# Altium project EP4CE6E22C8最小系统.PrjPCB
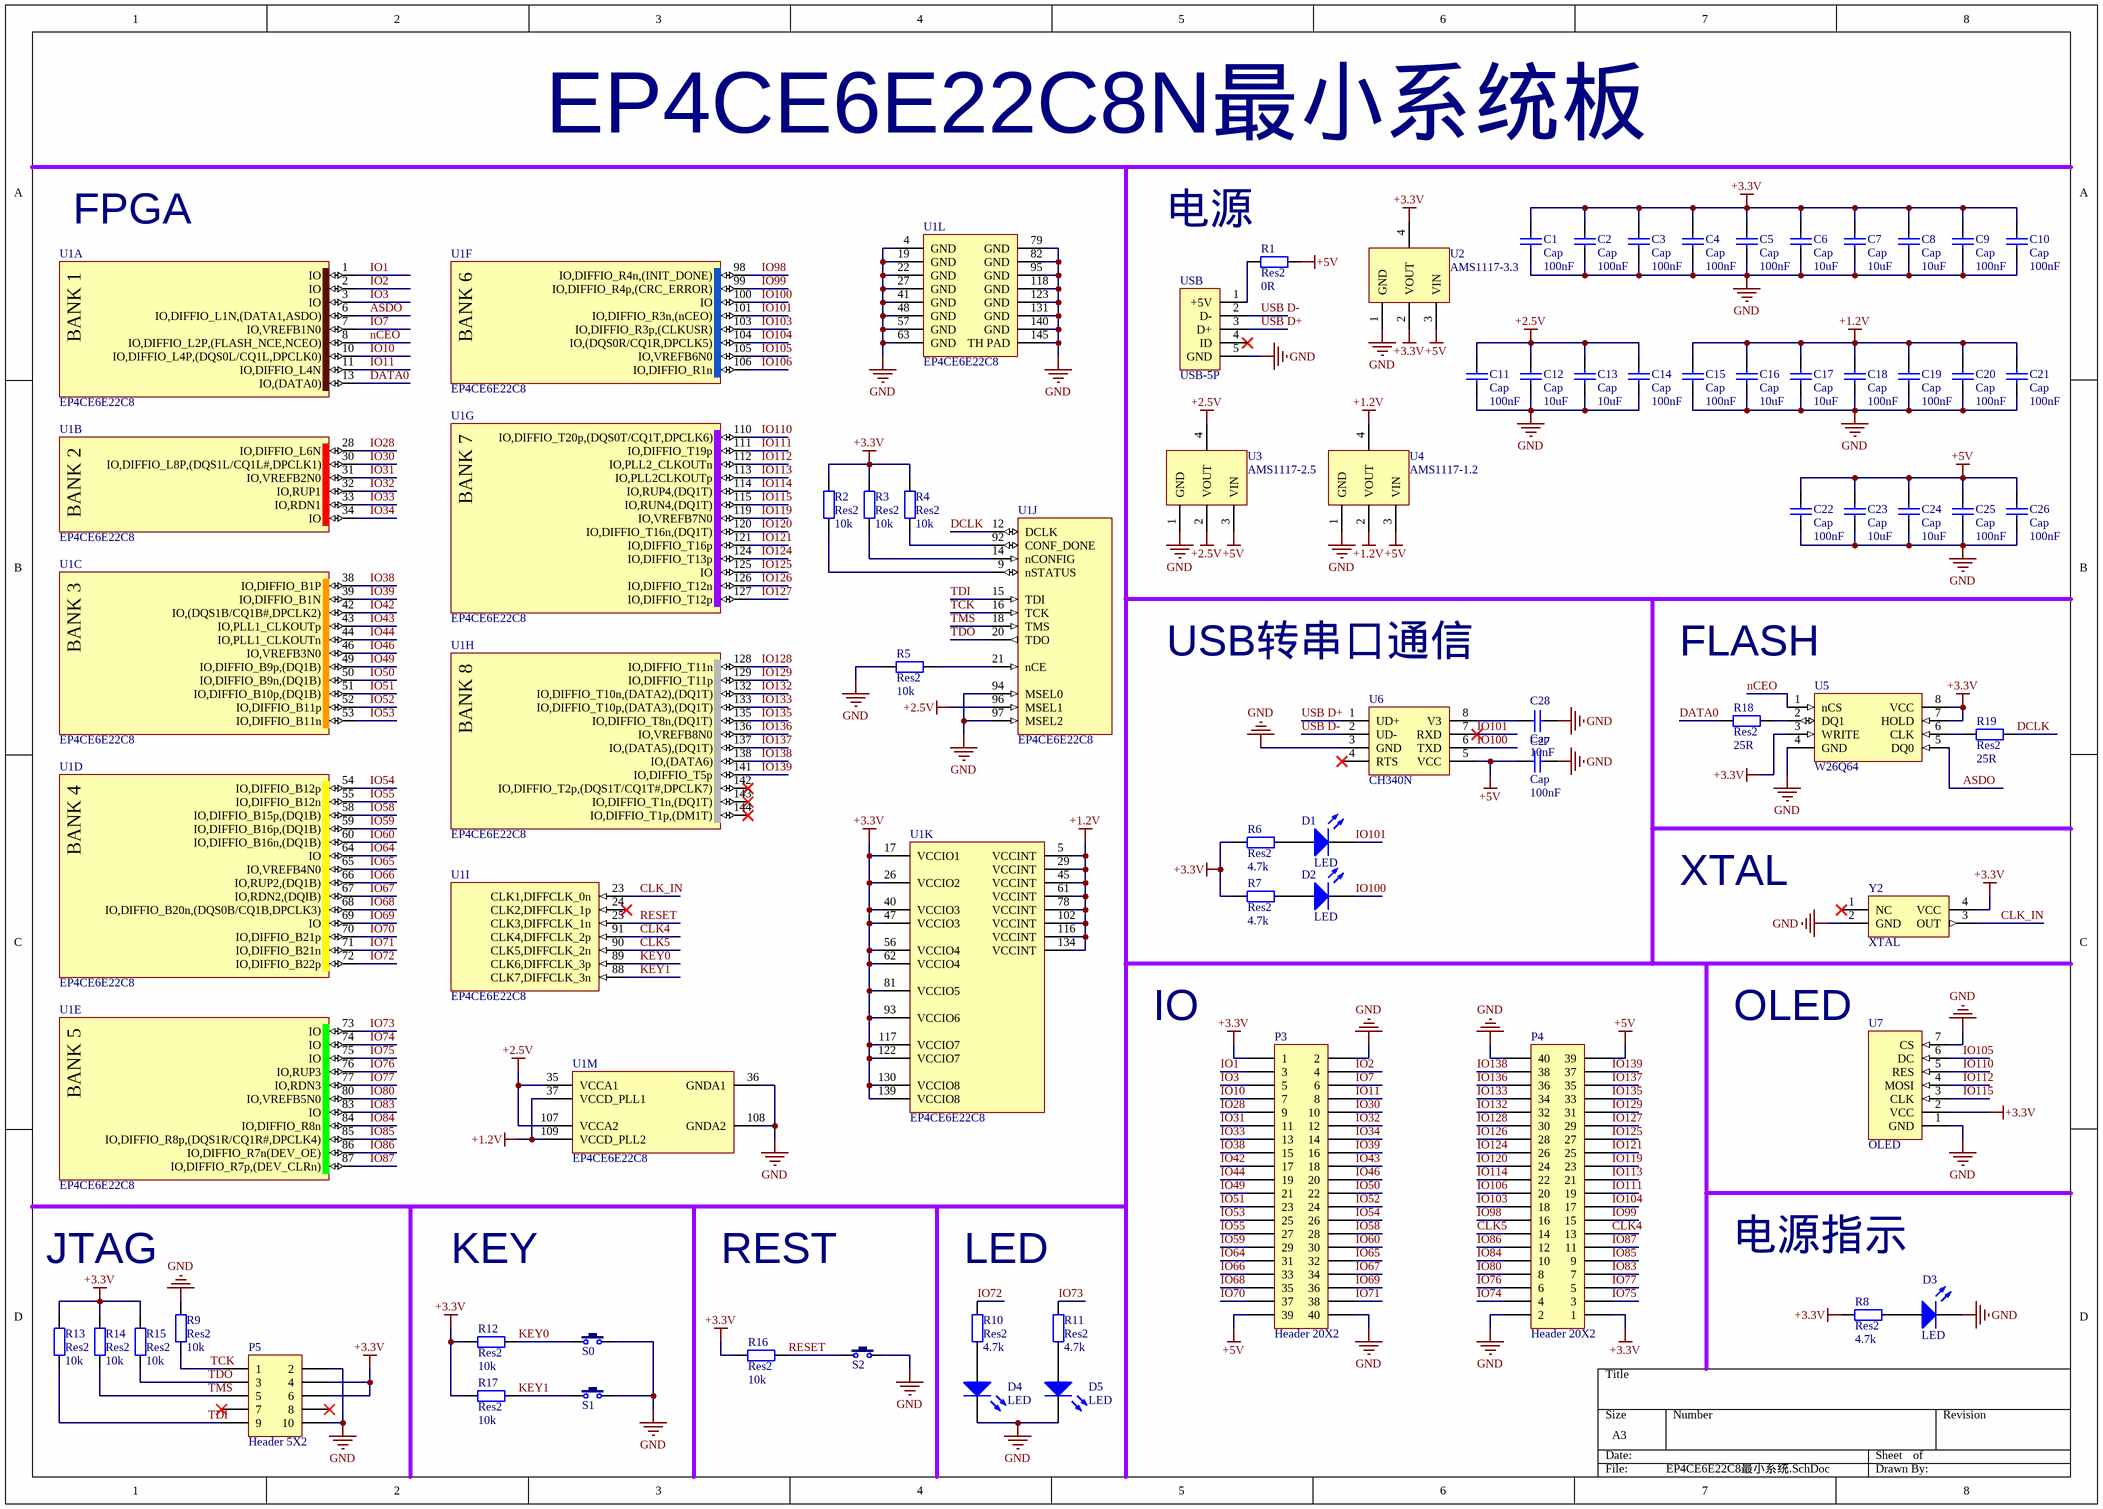
[diagram p0: EP4CE6E22C8最小系统.SchDoc]
1 sheet, 67 parts. Net scope: global (net labels, ports and power ports of the same name join across sheets).
Board file: EP4CE6E22C8最小系统.PcbDoc

## Sheet EP4CE6E22C8最小系统.SchDoc
size A3

### Parts
C1  Cap  value 100nF  [C 0603]
C2  Cap  value 100nF  [C 0603]
C3  Cap  value 100nF  [C 0603]
C4  Cap  value 100nF  [C 0603]
C5  Cap  value 100nF  [C 0603]
C6  Cap  value 10uF  [C 0603]
C7  Cap  value 10uF  [C 0603]
C8  Cap  value 10uF  [C 0603]
C9  Cap  value 100nF  [C 0603]
C10  Cap  value 100nF  [C 0603]
C11  Cap  value 100nF  [C 0603]
C12  Cap  value 10uF  [C 0603]
C13  Cap  value 10uF  [C 0603]
C14  Cap  value 100nF  [C 0603]
C15  Cap  value 100nF  [C 0603]
C16  Cap  value 10uF  [C 0603]
C17  Cap  value 10uF  [C 0603]
C18  Cap  value 100nF  [C 0603]
C19  Cap  value 100nF  [C 0603]
C20  Cap  value 100nF  [C 0603]
C21  Cap  value 100nF  [C 0603]
C22  Cap  value 100nF  [C 0603]
C23  Cap  value 10uF  [C 0603]
C24  Cap  value 10uF  [C 0603]
C25  Cap  value 100nF  [C 0603]
C26  Cap  value 100nF  [C 0603]
C27  Cap  value 100nF  [C 0603]
C28  Cap  value 10nF  [C 0603]
D1  LED  [LED 0805R]
D2  LED  [LED 0805R]
D3  LED  [LED 0805R]
D4  LED  [LED 0805R]
D5  LED  [LED 0805R]
P3  Header 20X2  [HDR-20X2]
P4  Header 20X2  [HDR-20X2]
P5  Header 5X2  [牛角座10p]
R1  Res2  value 0R  [R 0805-HP]
R2  Res2  value 10k  [R 0805-HP]
R3  Res2  value 10k  [R 0805-HP]
R4  Res2  value 10k  [R 0805-HP]
R5  Res2  value 10k  [R 0805-HP]
R6  Res2  value 4.7k  [R 0805-HP]
R7  Res2  value 4.7k  [R 0805-HP]
R8  Res2  value 4.7k  [R 0805-HP]
R9  Res2  value 10k  [R 0805-HP]
R10  Res2  value 4.7k  [R 0805-HP]
R11  Res2  value 4.7k  [R 0805-HP]
R12  Res2  value 10k  [R 0805-HP]
R13  Res2  value 10k  [R 0805-HP]
R14  Res2  value 10k  [R 0805-HP]
R15  Res2  value 10k  [R 0805-HP]
R16  Res2  value 10k  [R 0805-HP]
R17  Res2  value 10k  [R 0805-HP]
R18  Res2  value 25R  [R 0805-HP]
R19  Res2  value 25R  [R 0805-HP]
S0  3x6x5  [TSW SMD-3*6*2.5]  (value not drawn)
S1  3x6x5  [TSW SMD-3*6*2.5]  (value not drawn)
S2  3x6x5  [TSW SMD-3*6*2.5]  (value not drawn)
U1  EP4CE6E22C8  [EQFP144_M]  (parts A,B,C,D,E,F,G,H,I,J,K,L,M of 13)
U2  AMS1117-3.3  [SOT223_M]
U3  AMS1117-2.5  [SOT223_M]
U4  AMS1117-1.2  [SOT223_M]
U5  W26Q64  [SOP8_M]
U6  CH340N  [SOP8_M]
U7  OLED  [HDR-1X7_M]
USB  USB-5P  [USB-MICRO_B]
Y2  XTAL  [XTAL-3225]

### Nets
+1.2V: C15.2 C16.2 C17.2 C18.2 C19.2 C20.2 C21.2 U1.5(VCCINT) U1.29(VCCINT) U1.37(VCCD_PLL1) U1.45(VCCINT) U1.61(VCCINT) U1.78(VCCINT) U1.102(VCCINT) U1.109(VCCD_PLL2) U1.116(VCCINT) U1.134(VCCINT) U4.2(VOUT) U4.4(VOUT)
+2.5V: C11.2 C12.2 C13.2 C14.2 U1.35(VCCA1) U1.96(MSEL1) U1.107(VCCA2) U3.2(VOUT) U3.4(VOUT)
+3.3V: C1.2 C2.2 C3.2 C4.2 C5.2 C6.2 C7.2 C8.2 C9.2 C10.2 P3.1 P4.1 P5.4 P5.6 R2.1 R3.1 R4.1 R6.2 R7.2 R8.2 R12.1 R13.1 R14.1 R15.1 R16.1 R17.1 U1.17(VCCIO1) U1.26(VCCIO2) U1.40(VCCIO3) U1.47(VCCIO3) U1.56(VCCIO4) U1.62(VCCIO4) U1.81(VCCIO5) U1.93(VCCIO6) U1.117(VCCIO7) U1.122(VCCIO7) U1.130(VCCIO8) U1.139(VCCIO8) U2.2(VOUT) U2.4(VOUT) U5.3(WRITE) U5.7(HOLD) U5.8(VCC) U7.2(VCC) Y2.4(VCC)
+5V: C22.2 C23.2 C24.2 C25.2 C26.2 C27.2 P3.39 P4.39 R1.2 U2.3(VIN) U3.3(VIN) U4.3(VIN) U6.5(VCC)
GND: C1.1 C2.1 C3.1 C4.1 C5.1 C6.1 C7.1 C8.1 C9.1 C10.1 C11.1 C12.1 C13.1 C14.1 C15.1 C16.1 C17.1 C18.1 C19.1 C20.1 C21.1 C22.1 C23.1 C24.1 C25.1 C26.1 C27.1 C28.1 D3.2(K) D4.2(K) D5.2(K) P3.2 P3.40 P4.2 P4.40 P5.2 P5.10 R5.1 R9.1 S0.2 S1.2 S2.2 U1.4(GND) U1.19(GND) U1.22(GND) U1.27(GND) U1.36(GNDA1) U1.41(GND) U1.48(GND) U1.57(GND) U1.63(GND) U1.79(GND) U1.82(GND) U1.94(MSEL0) U1.95(GND) U1.97(MSEL2) U1.108(GNDA2) U1.118(GND) U1.123(GND) U1.131(GND) U1.140(GND) U1.145(TH_PAD) U2.1(GND) U3.1(GND) U4.1(GND) U5.4(GND) U6.3(GND) U7.1(GND) U7.7(CS) USB.5(GND) Y2.2(GND)
ASDO: U1.6(IO,DIFFIO_L1N,(DATA1,ASDO)) U5.5(DQ0)
CLK4: P4.13 U1.91(CLK4,DIFFCLK_2p)
CLK5: P4.14 U1.90(CLK5,DIFFCLK_2n)
CLK_IN: U1.23(CLK1,DIFFCLK_0n) Y2.3(OUT)
DATA0: R18.2 U1.13(IO,(DATA0))
DCLK: R19.1 U1.12(DCLK)
IO1: P3.3 U1.1(IO)
IO2: P3.4 U1.2(IO)
IO3: P3.5 U1.3(IO)
IO7: P3.6 U1.7(IO,VREFB1N0)
IO10: P3.7 U1.10(IO,DIFFIO_L4P,(DQS0L/CQ1L,DPCLK0))
IO11: P3.8 U1.11(IO,DIFFIO_L4N)
IO28: P3.9 U1.28(IO,DIFFIO_L6N)
IO30: P3.10 U1.30(IO,DIFFIO_L8P,(DQS1L/CQ1L#,DPCLK1))
IO31: P3.11 U1.31(IO,VREFB2N0)
IO32: P3.12 U1.32(IO,RUP1)
IO33: P3.13 U1.33(IO,RDN1)
IO34: P3.14 U1.34(IO)
IO38: P3.15 U1.38(IO,DIFFIO_B1P)
IO39: P3.16 U1.39(IO,DIFFIO_B1N)
IO42: P3.17 U1.42(IO,(DQS1B/CQ1B#,DPCLK2))
IO43: P3.18 U1.43(IO,PLL1_CLKOUTp)
IO44: P3.19 U1.44(IO,PLL1_CLKOUTn)
IO46: P3.20 U1.46(IO,VREFB3N0)
IO49: P3.21 U1.49(IO,DIFFIO_B9p,(DQ1B))
IO50: P3.22 U1.50(IO,DIFFIO_B9n,(DQ1B))
IO51: P3.23 U1.51(IO,DIFFIO_B10p,(DQ1B))
IO52: P3.24 U1.52(IO,DIFFIO_B11p)
IO53: P3.25 U1.53(IO,DIFFIO_B11n)
IO54: P3.26 U1.54(IO,DIFFIO_B12p)
IO55: P3.27 U1.55(IO,DIFFIO_B12n)
IO58: P3.28 U1.58(IO,DIFFIO_B15p,(DQ1B))
IO59: P3.29 U1.59(IO,DIFFIO_B16p,(DQ1B))
IO60: P3.30 U1.60(IO,DIFFIO_B16n,(DQ1B))
IO64: P3.31 U1.64(IO)
IO65: P3.32 U1.65(IO,VREFB4N0)
IO66: P3.33 U1.66(IO,RUP2,(DQ1B))
IO67: P3.34 U1.67(IO,RDN2,(DQIB))
IO68: P3.35 U1.68(IO,DIFFIO_B20n,(DQS0B/CQ1B,DPCLK3))
IO69: P3.36 U1.69(IO)
IO70: P3.37 U1.70(IO,DIFFIO_B21p)
IO71: P3.38 U1.71(IO,DIFFIO_B21n)
IO72: R10.2 U1.72(IO,DIFFIO_B22p)
IO73: R11.2 U1.73(IO)
IO74: P4.4 U1.74(IO)
IO75: P4.3 U1.75(IO)
IO76: P4.6 U1.76(IO,RUP3)
IO77: P4.5 U1.77(IO,RDN3)
IO80: P4.8 U1.80(IO,VREFB5N0)
IO83: P4.7 U1.83(IO)
IO84: P4.10 U1.84(IO,DIFFIO_R8n)
IO85: P4.9 U1.85(IO,DIFFIO_R8p,(DQS1R/CQ1R#,DPCLK4))
IO86: P4.12 U1.86(IO,DIFFIO_R7n(DEV_OE))
IO87: P4.11 U1.87(IO,DIFFIO_R7p,(DEV_CLRn))
IO98: P4.16 U1.98(IO,DIFFIO_R4n,(INIT_DONE))
IO99: P4.15 U1.99(IO,DIFFIO_R4p,(CRC_ERROR))
IO100: D2.2(K) U1.100(IO) U6.6(TXD)
IO101: D1.2(K) U1.101(IO,DIFFIO_R3n,(nCEO)) U6.7(RXD)
IO103: P4.18 U1.103(IO,DIFFIO_R3p,(CLKUSR))
IO104: P4.17 U1.104(IO,(DQS0R/CQ1R,DPCLK5))
IO105: U1.105(IO,VREFB6N0) U7.6(DC)
IO106: P4.20 U1.106(IO,DIFFIO_R1n)
IO110: U1.110(IO,DIFFIO_T20p,(DQS0T/CQ1T,DPCLK6)) U7.5(RES)
IO111: P4.19 U1.111(IO,DIFFIO_T19p)
IO112: U1.112(IO,PLL2_CLKOUTn) U7.4(MOSI)
IO113: P4.21 U1.113(IO,PLL2CLKOUTp)
IO114: P4.22 U1.114(IO,RUP4,(DQ1T))
IO115: U1.115(IO,RUN4,(DQ1T)) U7.3(CLK)
IO119: P4.23 U1.119(IO,VREFB7N0)
IO120: P4.24 U1.120(IO,DIFFIO_T16n,(DQ1T))
IO121: P4.25 U1.121(IO,DIFFIO_T16p)
IO124: P4.26 U1.124(IO,DIFFIO_T13p)
IO125: P4.27 U1.125(IO)
IO126: P4.28 U1.126(IO,DIFFIO_T12n)
IO127: P4.29 U1.127(IO,DIFFIO_T12p)
IO128: P4.30 U1.128(IO,DIFFIO_T11n)
IO129: P4.31 U1.129(IO,DIFFIO_T11p)
IO132: P4.32 U1.132(IO,DIFFIO_T10n,(DATA2),(DQ1T))
IO133: P4.34 U1.133(IO,DIFFIO_T10p,(DATA3),(DQ1T))
IO135: P4.33 U1.135(IO,DIFFIO_T8n,(DQ1T))
IO136: P4.36 U1.136(IO,VREFB8N0)
IO137: P4.35 U1.137(IO,(DATA5),(DQ1T))
IO138: P4.38 U1.138(IO,(DATA6))
IO139: P4.37 U1.141(IO,DIFFIO_T5p)
KEY0: R12.2 S0.1 U1.89(CLK6,DIFFCLK_3p)
KEY1: R17.2 S1.1 U1.88(CLK7,DIFFCLK_3n)
nCEO: U1.8(IO,DIFFIO_L2P,(FLASH_NCE,NCEO)) U5.1(nCS)
RESET: R16.2 S2.1 U1.25(CLK3,DIFFCLK_1n)
TCK: P5.1 R9.2 U1.16(TCK)
TDI: P5.9 R13.2 U1.15(TDI)
TDO: P5.3 R15.2 U1.20(TDO)
TMS: P5.5 R14.2 U1.18(TMS)
USB D+: U6.1(UD+) USB.3(D+)
USB D-: U6.2(UD-) USB.2(D-)
NetC28_2: C28.2 U6.8(V3)
NetD1_1: D1.1(A) R6.1
NetD2_1: D2.1(A) R7.1
NetD3_1: D3.1(A) R8.1
NetD4_1: D4.1(A) R10.1
NetD5_1: D5.1(A) R11.1
NetR1_1: R1.1 USB.1(+5V)
NetR2_2: R2.2 U1.9(nSTATUS)
NetR3_2: R3.2 U1.14(nCONFIG)
NetR4_2: R4.2 U1.92(CONF_DONE)
NetR5_2: R5.2 U1.21(nCE)
NetR18_1: R18.1 U5.2(DQ1)
NetR19_2: R19.2 U5.6(CLK)

Not connected (* = marked no-connect by the designer): P5 7* 8*; U1 24(CLK2,DIFFCLK_1p)* 142(IO,DIFFIO_T2p,(DQS1T/CQ1T#,DPCLK7))* 143(IO,DIFFIO_T1n,(DQ1T))* 144(IO,DIFFIO_T1p,(DM1T))*; U6 4(RTS)*; USB 4(ID)*; Y2 1(NC)*

### Notes on the sheet
- EP4CE6E22C8N最小系统板
- FPGA
- 电源
- USB转串口通信
- FLASH
- XTAL
- IO
- OLED
- 电源指示
- JTAG
- KEY
- REST
- LED
- (in symbol EP4CE6E22C8, part A) BANK 1
- (in symbol EP4CE6E22C8, part B) BANK 2
- (in symbol EP4CE6E22C8, part C) BANK 3
- (in symbol EP4CE6E22C8, part D) BANK 4
- (in symbol EP4CE6E22C8, part E) BANK 5
- (in symbol EP4CE6E22C8, part F) BANK 6
- (in symbol EP4CE6E22C8, part G) BANK 7
- (in symbol EP4CE6E22C8, part H) BANK 8

### Library data of the parts
C1-C26 = Cap: Capacitor; Published: 8-Jun-2000; LatestRevisionDate: 17-Jul-2002; LatestRevisionNote: Re-released for DXP Platform.; PackageReference: RAD-0.3; Publisher: Altium Limited; PackageDescription: Radial Cap, Thru-Hole; 2 Leads; 0.3 in Pin Spacing
C27 C28 = Cap Semi: Capacitor (Semiconductor SIM Model); Published: 8-Jun-2000; LatestRevisionDate: 29-May-2009; LatestRevisionNote: IPC-7351 Footprint Added.; PackageReference: C1206; Publisher: Altium Limited; PackageDescription: Chip Capacitor
D1-D5 = LED0: Typical INFRARED GaAs LED; Published: 8-Jun-2000; LatestRevisionDate: 08-Jul-2005; LatestRevisionNote: Mech Layer 1 removed.; PackageReference: LED-0; Publisher: Altium Limited; PackageDescription: LED; 2 Leads
P3 P4 = Header 20X2: Header, 20-Pin, Dual row; LatestRevisionDate: 17-Jul-2002; LatestRevisionNote: Re-released for DXP Platform.; Publisher: Altium Limited
P5 = Header 5X2: Header, 5-Pin, Dual row; LatestRevisionDate: 17-Jul-2002; LatestRevisionNote: Re-released for DXP Platform.; Publisher: Altium Limited
R1-R19 = Res2: Resistor; Published: 8-Jun-2000; LatestRevisionDate: 17-Jul-2002; LatestRevisionNote: Re-released for DXP Platform.; PackageReference: AXIAL-0.4; Publisher: Altium Limited; PackageDescription: Axial Device, Thru-Hole; 2 Leads; 0.4 in Pin Spacing
S0-S2 = TSW 3x6: 3x6轻触开关; 版权归属: 黎明电子style; BOM名称: 3x6轻触开关; 学习资源: https://lmdzstyle.taobao.com/
U1 = EP4CE6E22C8: CYCLONE IV E  FPGA EP4CE6E22C8 144Pins speed 8
U2-U4 = AMS1117: 3.3Voutput,4.3-12Vinput LDO
U5 = W25Q64: FLASH
U6 = CH340G
U7 = OLED_SPI: 1.3寸或0.96寸SPI接口的OLED
USB = USB-5P: 微型USB母座; 版权归属: 黎明电子style; BOM名称: 微型USB母座; 学习资源: https://lmdzstyle.taobao.com/
Y2 = 有源晶振